# EAGLE design twitchie (EAGLE 5.10)
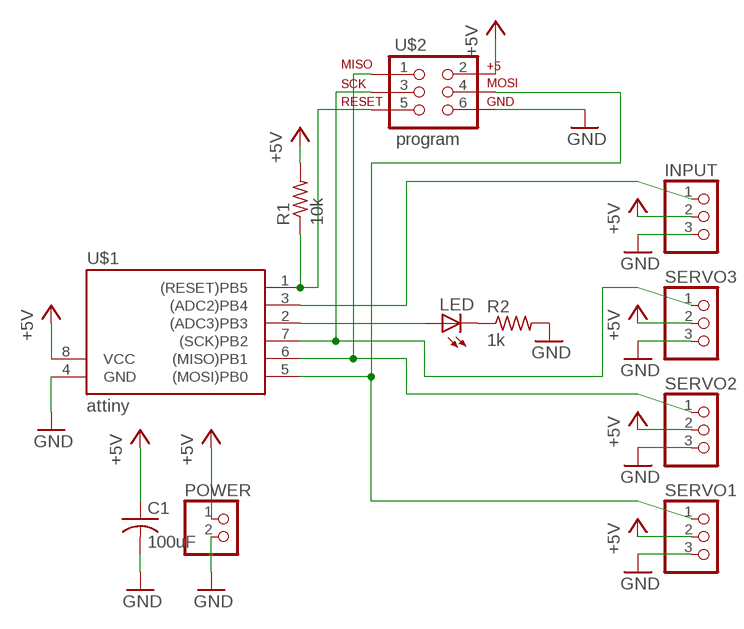
[diagram p0: schematic, sheet 1]

## Parts
C1  100uF  C-US025-050X050  [C025-050X050]
INPUT  PINHD-1X3  [1X03]
LED  LED5MM  [LED5MM]
POWER  PINHD-1X2  [1X02]
R1  10k  R-US_0204/5  [0204/5]
R2  1k  R-US_0204/5  [0204/5]
SERVO1  PINHD-1X3  [1X03]
SERVO2  PINHD-1X3  [1X03]
SERVO3  PINHD-1X3  [1X03]
U$1  attiny  TINY138P3  [DIL08]
U$2  program  AVR_SPI_PRG_6NS  [2X3-NS]

## Nets
+5V [power]: C1.1 INPUT.2 POWER.1 R1.2 SERVO1.2 SERVO2.2 SERVO3.2 U$1.8(VCC) U$2.2
GND [power]: C1.2 INPUT.3 POWER.2 R2.2 SERVO1.3 SERVO2.3 SERVO3.3 U$1.4(GND) U$2.6
N$1: SERVO1.1 U$1.5((MOSI)PB0) U$2.4
N$2: SERVO2.1 U$1.6((MISO)PB1) U$2.1
N$3: SERVO3.1 U$1.7((SCK)PB2) U$2.3
N$4: LED.A U$1.2((ADC3)PB3)
N$5: R1.1 U$1.1((RESET)PB5) U$2.5
N$6: LED.K(C) R2.1
N$7: INPUT.1 U$1.3((ADC2)PB4)

## Library data of the parts
C1 = rcl:C-US: CAPACITOR, American symbol
INPUT SERVO1-SERVO3 = pinhead:PINHD-1X3: PIN HEADER
LED = led:LED: LED OSRAM: - CHIPLED LG R971, LG N971, LY N971, LG Q971, LY Q971, LO R971, LY R971 LH N974, LH R974 LS Q976, LO Q976, LY Q976 LO Q996 - Hyper CHIPLED LW Q18S LB Q993, LB Q99A, LB R99A - SideLED LS A670, LO A670, LY A670, LG A670, LP A670 LB A673, LV A673, LT A673, LW A673 LH A674 LY A675 LS A676, LA A676, LO A676, LY A676, LW A676 LS A679, LY A679, LG A679 - Hyper Micro SIDELED® LS Y876, LA Y876, LO Y876, LY Y876 LT Y87S - SmartLED LW L88C, LW L88S LB L89C, LB L89S, LG L890 LS L89K, LO L89K, LY L89K LS L896, LA L896, LO L896, LY L896 - TOPLED LS T670, LO T670, LY T670, LG T670, LP T670 LSG T670, LSP T670, LSY T670, LOP T670, LYG T670 LG T671, LOG T671, LSG T671 LB T673, LV T673, LT T673, LW T673 LH T674 LS T676, LA T676, LO T676, LY T676, LB T676, LH T676, LSB T676, LW T676 LB T67C, LV T67C, LT T67C, LS T67K, LO T67K, LY T67K, LW E67C LS E67B, LA E67B, LO E67B, LY E67B, LB E67C, LV E67C, LT E67C LW T67C LS T679, LY T679, LG T679 LS T770, LO T770, LY T770, LG T770, LP T770 LB T773, LV T773, LT T773, LW T773 LH T774 LS E675, LA E675, LY E675, LS T675 LS T776, LA T776, LO T776, LY T776, LB T776 LHGB T686 LT T68C, LB T68C - Hyper Mini TOPLED® LB M676 - Mini TOPLED Santana® LG M470 LS M47K, LO M47K, LY M47K Source: http://www.osram.convergy.de LUXEON: - LUMILED® LXK2-PW12-R00, LXK2-PW12-S00, LXK2-PW14-U00, LXK2-PW14-V00 LXK2-PM12-R00, LXK2-PM12-S00, LXK2-PM14-U00 LXK2-PE12-Q00, LXK2-PE12-R00, LXK2-PE12-S00, LXK2-PE14-T00, LXK2-PE14-U00 LXK2-PB12-K00, LXK2-PB12-L00, LXK2-PB12-M00, LXK2-PB14-N00, LXK2-PB14-P00, LXK2-PB14-Q00 LXK2-PR12-L00, LXK2-PR12-M00, LXK2-PR14-Q00, LXK2-PR14-R00 LXK2-PD12-Q00, LXK2-PD12-R00, LXK2-PD12-S00 LXK2-PH12-R00, LXK2-PH12-S00 LXK2-PL12-P00, LXK2-PL12-Q00, LXK2-PL12-R00 Source: www.luxeon.com KINGBRIGHT: KA-3528ASYC Source: www.kingbright.com
POWER = pinhead:PINHD-1X2: PIN HEADER
R1 R2 = rcl:R-US_: RESISTOR, American symbol
U$1 = avr-4:TINY13*
U$2 = SparkFun10-6-08:AVR_SPI_PRG_6: AVR ISP 6 Pin This is the reduced ISP connector for AVR programming. Common on Arduino. This footprint will take up less PCB space and can be used with a 10-pin to 6-pin adapter such as SKU: BOB-08508

## Net classes
0 default: width 0.254 mm, drill 0.508 mm, clearance 0.254 mm
1 power: width 0.508 mm, drill 0.508 mm, clearance 0.254 mm

## Board
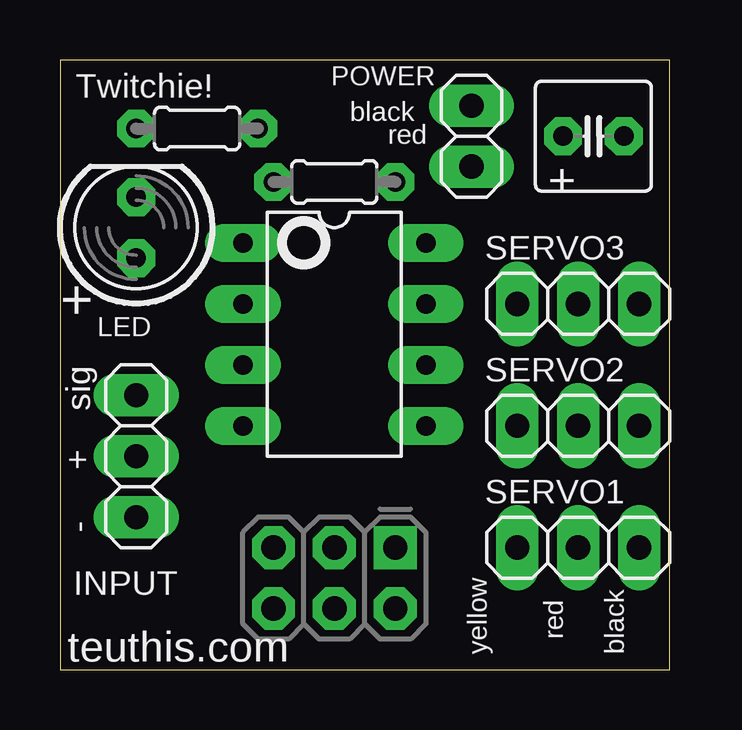
[diagram p1: board, top side]
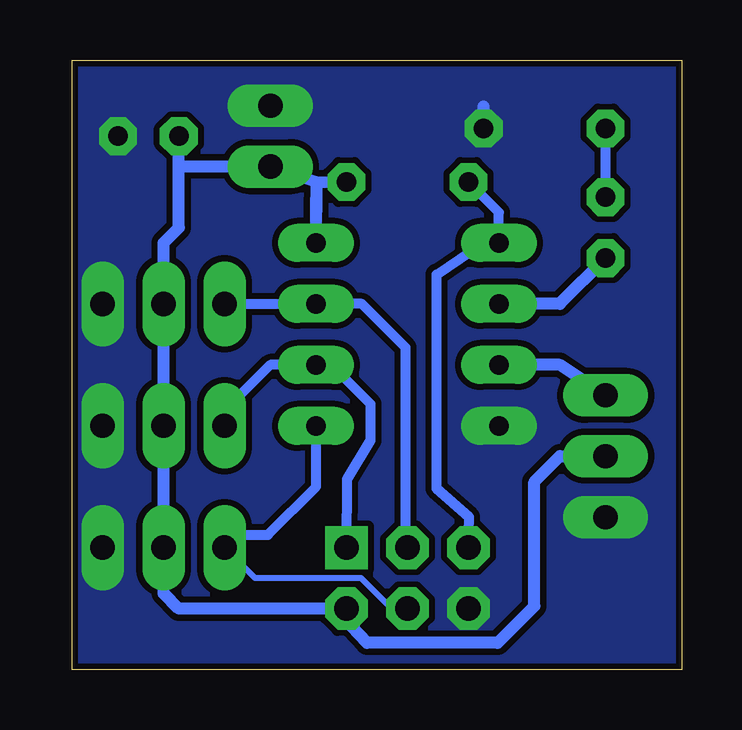
[diagram p2: board, bottom side, seen from below]

Size 25.4 x 25.4 mm. Coordinates in mm from the lower left corner, seen from the top.
Outline: 0,0 25.4,0 25.4,25.4 0,25.4 0,0
Copper layers (1*16): Top 0.035mm / dielectric 1.5mm / Bottom 0.035mm
Design rules "default *": minimum track width 10mil, minimum drill 24mil, track to track 10mil, track to pad 10mil, pad to pad 10mil, via to via 10mil, smd to smd 10mil, copper to edge 10mil, drill to drill 10mil, minimum pad ring 15mil, minimum via ring 15mil, stop-mask expansion 4mil, vias tented up to drill 0mil, thermal gap 10mil

### Footprints (pad centres in the part's own frame; a part is rotated, then mirrored left to right if it is on the bottom)
C025-050X050 = drill 0.813 octagon: 1 -1.27,0; 2 1.27,0
1X03 = drill 1.016 long: 1 -2.54,0; 2 0,0; 3 2.54,0
LED5MM = drill 0.813 octagon: A -1.27,0; K 1.27,0
1X02 = drill 1.016 long: 1 -1.27,0; 2 1.27,0
0204/5 = drill 0.813 octagon: 1 -2.54,0; 2 2.54,0
DIL08 = drill 0.813 long: 1 -3.81,-3.81; 2 -1.27,-3.81; 3 1.27,-3.81; 4 3.81,-3.81; 5 3.81,3.81; 6 1.27,3.81; 7 -1.27,3.81; 8 -3.81,3.81
2X3-NS = drill 1.016 square: 1 -2.54,-1.27 | drill 1.016 octagon: 2 -2.54,1.27; 3 0,-1.27; 4 0,1.27; 5 2.54,-1.27; 6 2.54,1.27

### Placement (x,y rotation side)
C1  22.23,22.23 0 top
INPUT  3.17,8.89 270 top
LED  3.17,18.41 90 top
POWER  17.14,22.23 90 top
R1  11.43,20.32 0 top
R2  5.71,22.54 0 top
SERVO1  21.59,5.08 0 top
SERVO2  21.59,10.16 0 top
SERVO3  21.59,15.24 0 top
U$1  11.43,13.97 270 top
U$2  11.43,3.81 180 top

### Tracks (layer width: path | path; a pad name or v marks a point on that pad's centre or on a via)
+5V
  Bottom 0.508: 15.24,20.32 13.99,20.3 R1.2 | 15.24,20.32 15.27,17.8 U$1.8 | 20.95,20.98 18.44,20.98 POWER.1 15.24,20.32 | 15.24,20.32 15.24,19.05 | 21.59,5 21.59,3.17 20.95,2.54 U$2.2 13.74,1.8 13.11,1.12 7.67,1.12 6.15,2.64 6.15,7.82 5.08,8.89 INPUT.2 | 21.59,5 SERVO1.2 | SERVO1.2 21.64,4.98 21.59,5 | SERVO1.2 SERVO2.2 SERVO3.2 21.59,17.78 20.95,18.41 20.95,20.98 | 20.95,20.98 C1.1
GND
  Bottom 0.508: 17.75,23.47 17.12,23.52 POWER.2 | R2.2 8.26,23.47
  pour Bottom (no thermals): 0,25.4 25.4,25.4 25.4,0 0,0
N$1
  Bottom 0.254: SERVO1.1 18.52,5.61 18.44,5.54 SERVO1.1 | SERVO1.1 17.78,3.81 13.36,3.81 12.09,2.54 U$2.4
  Bottom 0.406: 18.52,5.61 17.25,5.61 15.24,7.62 U$1.5
N$2
  Bottom 0.254: SERVO2.1 18.41,10.79 18.41,11.43
  Bottom 0.406: 18.41,11.43 17.14,12.7 U$1.6 14.61,12.7 12.97,11.06 12.97,9.55 13.95,7.94 U$2.1
N$3
  Bottom 0.254: 19.68,15.21 SERVO3.1 | U$1.7 13.99,15.21 | 11.51,4.5 11.46,4.45 U$2.3
  Bottom 0.406: 13.99,15.21 19.68,15.21 | 11.51,4.5 11.51,13.41 13.34,15.24 U$1.7
N$4
  Bottom 0.508: LED.A 5.08,15.24 U$1.2
N$5
  Bottom 0.406: R1.1 7.62,19.05 U$1.1 8.26,17.78 10.21,16.46 10.21,7.54 8.87,6.35 U$2.5
N$6
  Bottom 0.406: LED.K R2.1
N$7
  Bottom 0.508: U$1.3 5.08,12.7 INPUT.1

### Text on the board
tPlace: Twitchie! | black | red | + | + | sig | + | - | yellow | red | black | teuthis.com